# EAGLE design EKG_Pulse_Detection (EAGLE 9.3.1)
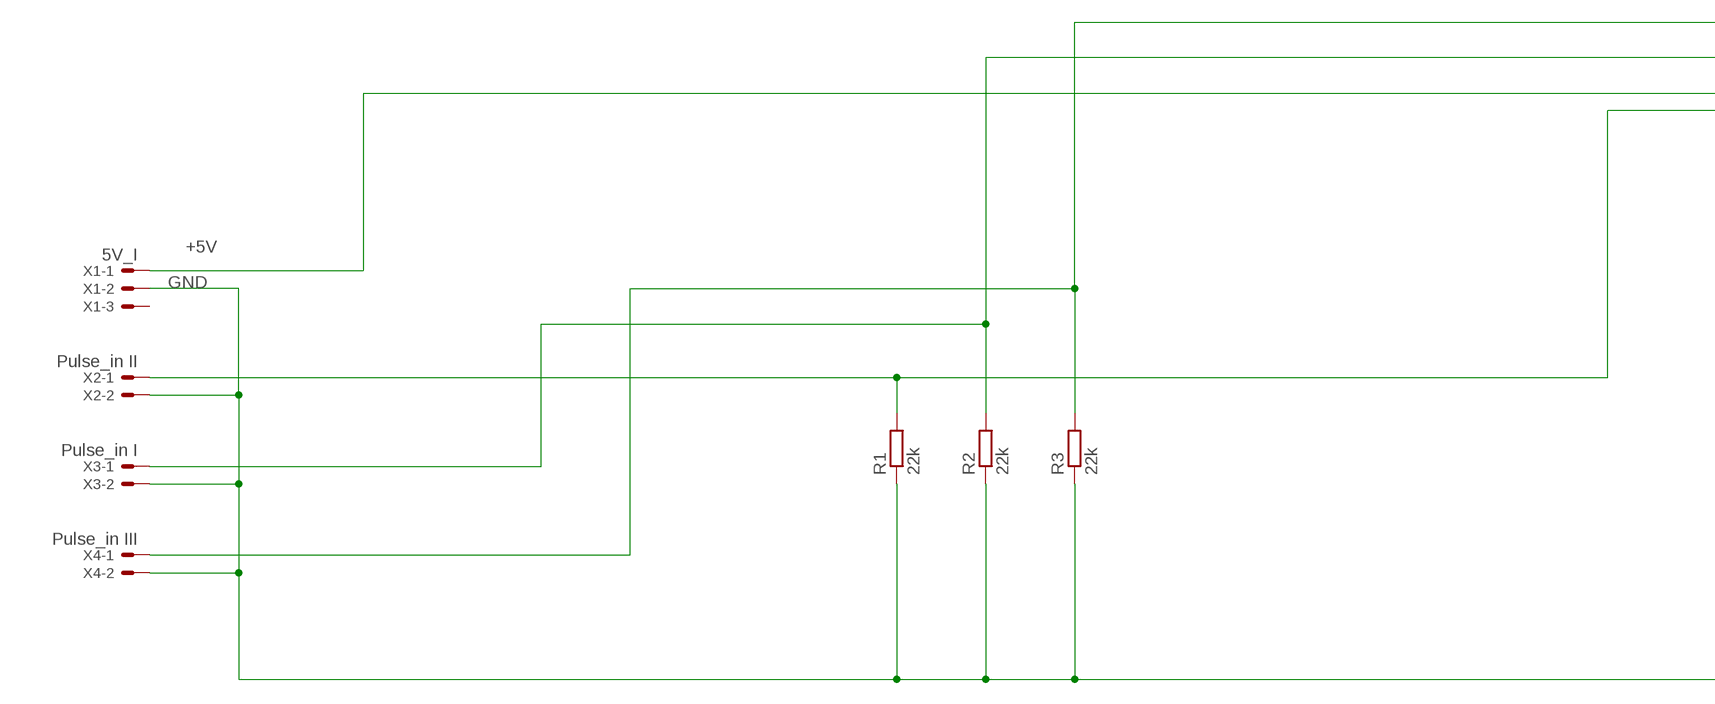
[diagram p0: schematic, sheet 1, part 1 of 2]
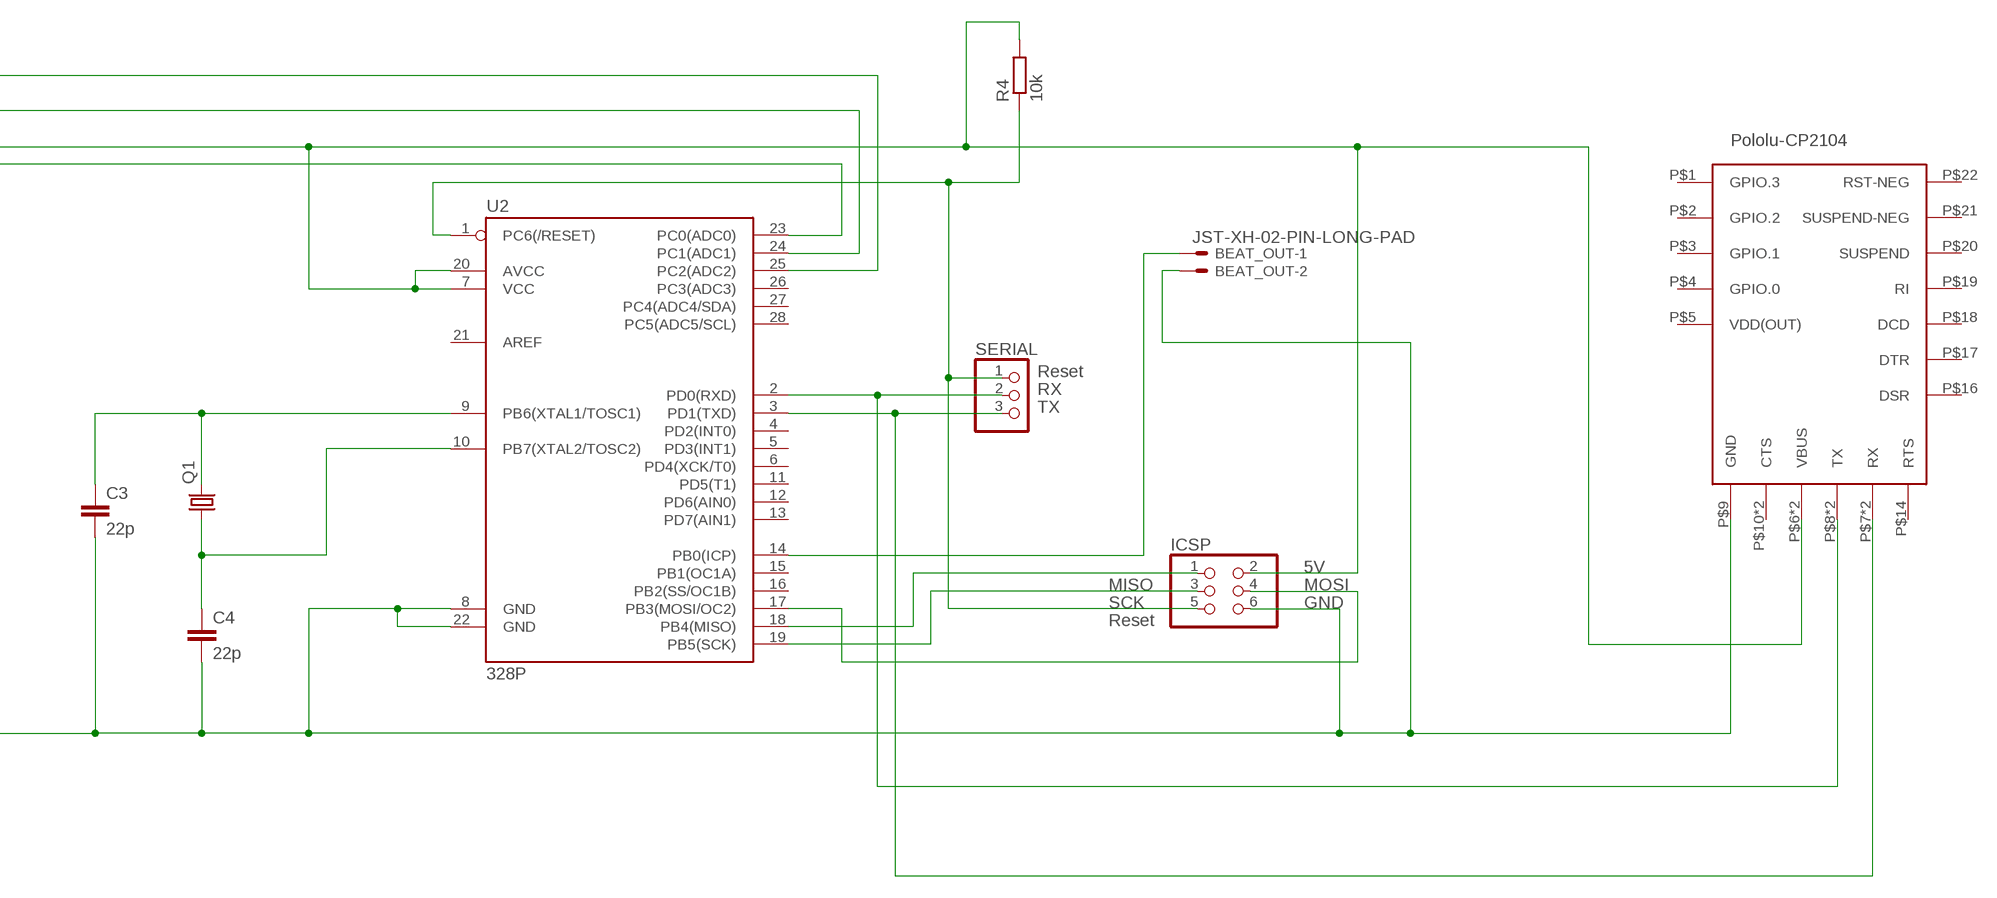
[diagram p1: schematic, sheet 1, part 2 of 2]

## Parts
BEAT_OUT  JST-XH-02-PIN-LONG-PAD  [JST-XH-02-PACKAGE-LONG-PAD]
C3  22p  C2,5-3  [C2.5-3]
C4  22p  C2,5-3  [C2.5-3]
ICSP  PINHD-2X3  [2X03]
Q1  CRYSTALHC49S  [HC49/S]
R1  22k  R-EU_0207/7  [0207/7]
R2  22k  R-EU_0207/7  [0207/7]
R3  22k  R-EU_0207/7  [0207/7]
R4  10k  R-EU_0207/7  [0207/7]
SERIAL  PINHD-1X3  [1X03]
U2  328P  ATMEGA328P_PDIP  [DIP28]
U$1  POLOLU_CP2104  [POLOLUCP2104]
X1  5V_I  JST-XH-03-PIN-LONG-PAD  [JST-XH-03-PACKAGE-LONG-PAD]
X2  Pulse_in II  JST-XH-02-PIN-LONG-PAD  [JST-XH-02-PACKAGE-LONG-PAD]
X3  Pulse_in I  JST-XH-02-PIN-LONG-PAD  [JST-XH-02-PACKAGE-LONG-PAD]
X4  Pulse_in III  JST-XH-02-PIN-LONG-PAD  [JST-XH-02-PACKAGE-LONG-PAD]

## Nets
+5V: ICSP.2 R4.2 U2.7(VCC) U2.20(AVCC) U$1.P$6(VBUS) U$1.P$11(VBUS) X1.1
GND: BEAT_OUT.2 C3.2 C4.2 ICSP.6 R1.1 R2.1 R3.1 U2.8(GND) U2.22(GND) U$1.P$9(GND) X1.2 X2.2 X3.2 X4.2
N$1: R1.2 U2.23(PC0(ADC0)) X2.1
N$2: R2.2 U2.24(PC1(ADC1)) X3.1
N$3: R3.2 U2.25(PC2(ADC2)) X4.1
N$9: C3.1 Q1.2 U2.9(PB6(XTAL1/TOSC1))
N$10: C4.1 Q1.1 U2.10(PB7(XTAL2/TOSC2))
N$12: ICSP.1 U2.18(PB4(MISO))
N$17: ICSP.3 U2.19(PB5(SCK))
N$19: ICSP.4 U2.17(PB3(MOSI/OC2))
N$21: BEAT_OUT.1 U2.14(PB0(ICP))
RESET: ICSP.5 R4.1 SERIAL.1 U2.1(PC6(/RESET))
RX: SERIAL.2 U2.2(PD0(RXD)) U$1.P$8(TX) U$1.P$12(TX)
TX: SERIAL.3 U2.3(PD1(TXD)) U$1.P$7(RX) U$1.P$13(RX)
Unconnected: U2.4(PD2(INT0)) U2.5(PD3(INT1)) U2.6(PD4(XCK/T0)) U2.11(PD5(T1)) U2.12(PD6(AIN0)) U2.13(PD7(AIN1)) U2.15(PB1(OC1A)) U2.16(PB2(SS/OC1B)) U2.21(AREF) U2.26(PC3(ADC3)) U2.27(PC4(ADC4/SDA)) U2.28(PC5(ADC5/SCL)) U$1.P$1(GPIO.3) U$1.P$2(GPIO.2) U$1.P$3(GPIO.1) U$1.P$4(GPIO.0) U$1.P$10(CTS) U$1.P$14(RTS) U$1.P$15(CTS) U$1.P$16(DSR) U$1.P$17(DTR) U$1.P$18(DCD) U$1.P$19(RI) U$1.P$20(SUSPEND) U$1.P$21(SUSPEND-NEG) U$1.P$22(RST-NEG) X1.3

## Notes on the sheet
- Reset
- RX
- TX
- 5V
- MISO | MOSI
- SCK | GND
- Reset

## Power pins joined to a net without a drawn wire
VDD(OUT): U$1.P$5(VDD(OUT))

## Library data of the parts
BEAT_OUT X2-X4 = Rembrandt Electronics - JST XH Connectors v1-0:JST-XH-02-PIN: JST XH Connector 2 Pin Wire to board connector. Pitch: 2,54 mm, (0.100") Number of pins: 2 Created by Rembrandt Electronics www.rembrandtelectronics.com
C3 C4 = capacitor-wima:C: CAPACITOR naming: grid - package width
ICSP = pinhead:PINHD-2X3: PIN HEADER
Q1 = adafruit:CRYSTAL: CRYSTAL; OC_FARNELL: 1667008; OC_NEWARK: unknown
R1-R4 = rcl:R-EU_: RESISTOR, European symbol; SPICEPREFIX: R
SERIAL = pinhead:PINHD-1X3: PIN HEADER
U2 = SparkFun-IC-Microcontroller:ATMEGA328P_PDIP: Atmel 328P Through hole ATMEGA328P uC used in the Arduino 32kb flash, 1k EEPROM, 2k SRAM Datasheet <http://www.sparkfun.com/datasheets/Components/SMD/ATMega328.pdf> SparkFun Products Storefront component: AVR 28 Pin 20MHz 32K 6A/D - ATMega328P <https://www.sparkfun.com/products/9061> (COM-09061) SparkFun Simon Says - Through-Hole Soldering Kit <https://www.sparkfun.com/products/10547> (KIT-10547) SparkFun Learn to Solder - Simon Says <https://www.sparkfun.com/products/13708> (KIT-13708) SparkFun BigTime Watch Kit <https://www.sparkfun.com/products/11734> (KIT-11734) SparkFun ClockIt <https://www.sparkfun.com/products/10930> (KIT-10930) SparkFun Serial Enabled LCD Kit <https://www.sparkfun.com/products/10097> (LCD-10097) SparkFun Simon Tilts - Through Hole Soldering Kit <https://www.sparkfun.com/products/12634> (KIT-12634) SparkFun Frequency Counter Kit <https://www.sparkfun.com/products/10140> (KIT-10140) FabFM Radio Kit <https://www.sparkfun.com/products/11043> (KIT-11043) SparkFun Binary Blaster Kit <https://www.sparkfun.com/products/12037> (KIT-12037) SparkFun Metro-Gnome <https://www.sparkfun.com/products/9236> (KIT-09236) ATmega328 with Arduino Optiboot (Uno) <https://www.sparkfun.com/products/10524> (DEV-10524); PROD_ID: IC-09136
U$1 = POLOLU_CP2104:POLOLU_CP2104: TTL zu USB Konverter
X1 = Rembrandt Electronics - JST XH Connectors v1-0:JST-XH-03-PIN: JST XH Connector 2 Pin Wire to board connector. Pitch: 2,54 mm, (0.100") Number of pins: 3 Created by Rembrandt Electronics www.rembrandtelectronics.com

## Board
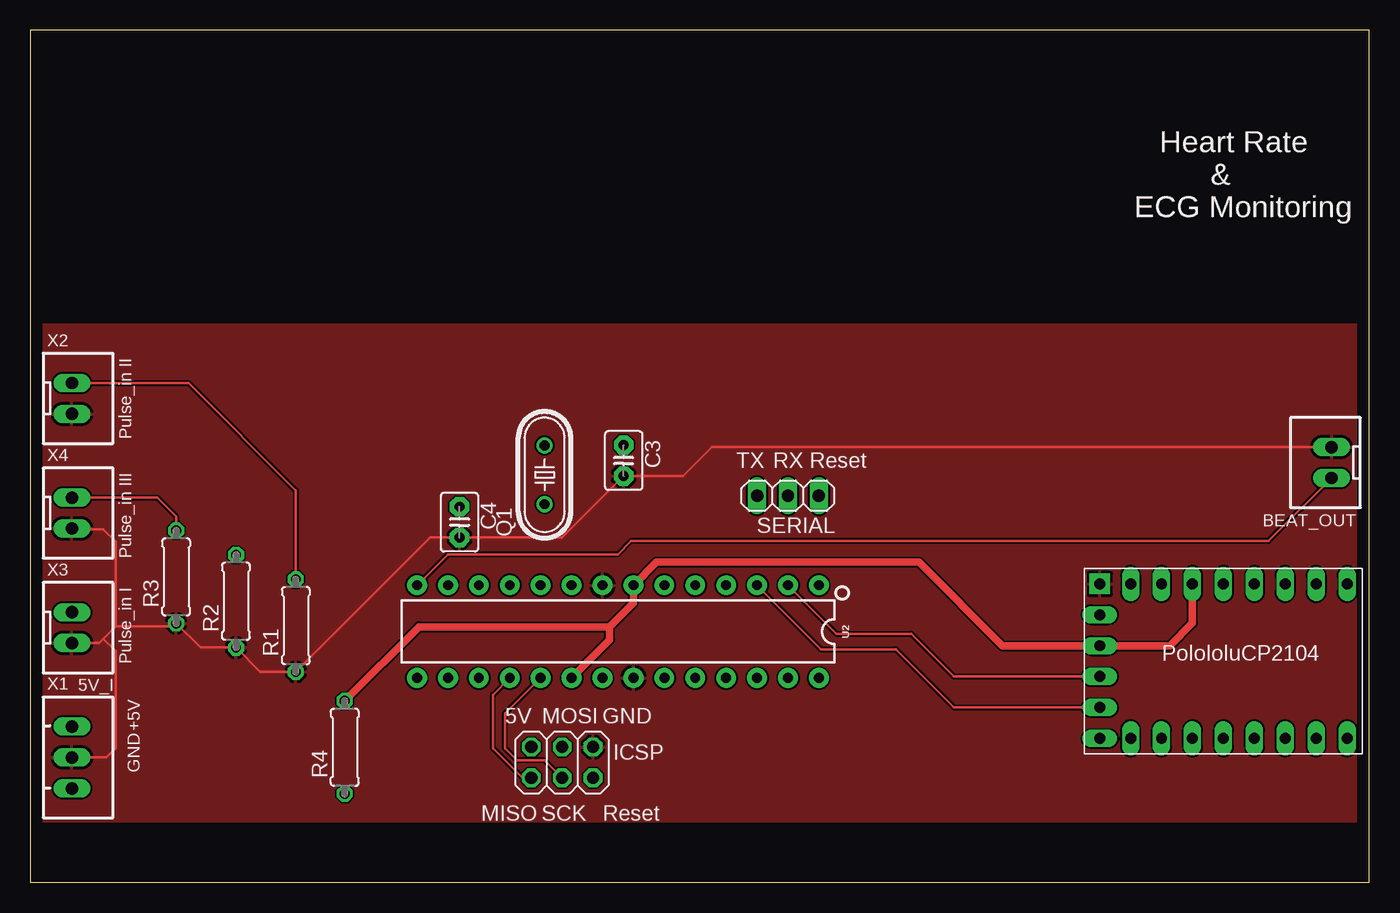
[diagram p2: board, top side]
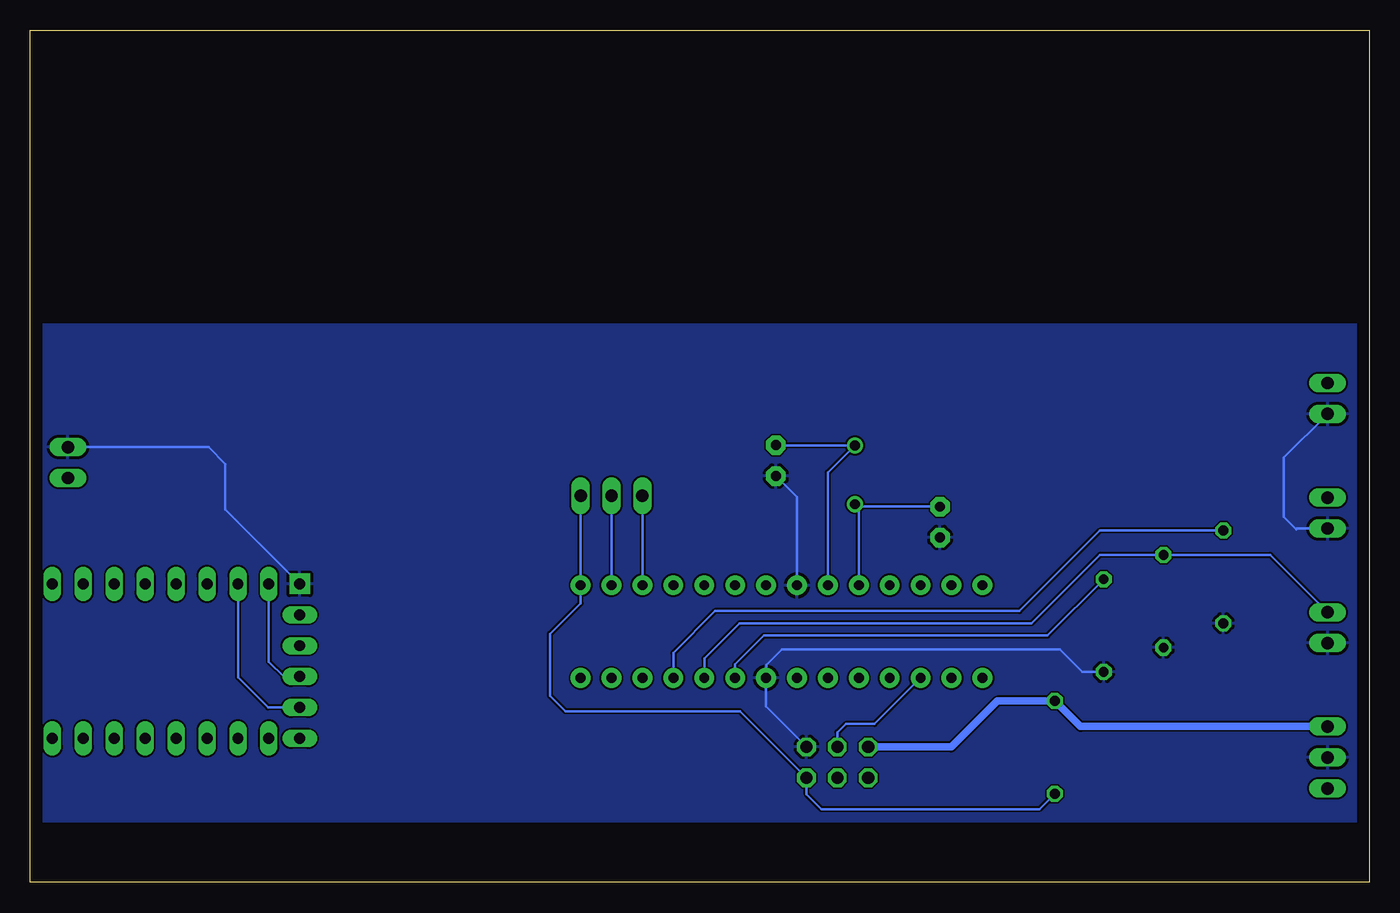
[diagram p3: board, bottom side, seen from below]

Size 110 x 70.01 mm. Coordinates in mm from the lower left corner, seen from the top.
Outline: 0,0 110,0 110,70.01 0,70.01 0,0
Copper layers (1*16): Top 0.035mm / dielectric 1.5mm / Bottom 0.035mm
Design rules "default": minimum track width 6mil, minimum drill 0.35mm, track to track 6mil, track to pad 6mil, pad to pad 6mil, via to via 6mil, smd to smd 6mil, copper to edge 40mil, drill to drill 6mil, minimum pad ring 10mil, minimum via ring 8mil, stop-mask expansion 4mil, vias tented up to drill 0mil, thermal gap 10mil

### Footprints (pad centres in the part's own frame; a part is rotated, then mirrored left to right if it is on the bottom)
JST-XH-02-PACKAGE-LONG-PAD = drill 1.016 long: 1 -1.27,0; 2 1.27,0
C2.5-3 = drill 0.813 pad 1.6 octagon: 1 -1.27,0; 2 1.27,0
2X03 = drill 1.016 octagon: 1 -2.54,-1.27; 2 -2.54,1.27; 3 0,-1.27; 4 0,1.27; 5 2.54,-1.27; 6 2.54,1.27
HC49/S = drill 0.813: 1 -2.413,0; 2 2.413,0
0207/7 = drill 0.813 octagon: 1 -3.81,0; 2 3.81,0
1X03 = drill 1.016 long: 1 -2.54,0; 2 0,0; 3 2.54,0
DIP28 = drill 0.813 pad 1.626: 1 -16.51,-3.81; 2 -13.97,-3.81; 3 -11.43,-3.81; 4 -8.89,-3.81; 5 -6.35,-3.81; 6 -3.81,-3.81; 7 -1.27,-3.81; 8 1.27,-3.81; 9 3.81,-3.81; 10 6.35,-3.81; 11 8.89,-3.81; 12 11.43,-3.81; 13 13.97,-3.81; 14 16.51,-3.81; 15 16.51,3.81; 16 13.97,3.81; 17 11.43,3.81; 18 8.89,3.81; 19 6.35,3.81; 20 3.81,3.81; 21 1.27,3.81; 22 -1.27,3.81; 23 -3.81,3.81; 24 -6.35,3.81; 25 -8.89,3.81; 26 -11.43,3.81; 27 -13.97,3.81; 28 -16.51,3.81
POLOLUCP2104 = drill 0.9 pad 1.422 long: P$1 1.27,-1.27; P$2 1.27,-3.81; P$3 1.27,-6.35; P$4 1.27,-8.89; P$5 1.27,-11.43; P$6 1.27,-13.97; P$7 1.27,-16.51; P$8 1.27,-19.05; P$10 3.81,-21.59; P$11 6.35,-21.59; P$12 8.89,-21.59; P$13 11.43,-21.59; P$14 13.97,-21.59; P$15 13.97,-19.05; P$16 13.97,-16.51; P$17 13.97,-13.97; P$18 13.97,-11.43; P$19 13.97,-8.89; P$20 13.97,-6.35; P$21 13.97,-3.81; P$22 13.97,-1.27 | drill 0.9 pad 1.676 square: P$9 1.27,-21.59
JST-XH-03-PACKAGE-LONG-PAD = drill 1.016 long: 1 -2.54,0; 2 0,0; 3 2.54,0

### Placement (x,y rotation side)
BEAT_OUT  106.92,34.5 90 top
C3  48.75,34.66 270 top
C4  35.25,29.6 270 top
ICSP  43.69,9.86 0 top
Q1  42.25,33.49 90 top
R1  21.81,21.1 90 top
R2  16.89,23.1 90 top
R3  11.97,25.1 90 top
R4  25.83,11.1 90 top
SERIAL  62.25,31.77 180 top
U2  48.28,20.61 180 top
U$1  109.46,25.8 270 top
X1  3.41,10.26 270 top
X2  3.41,39.77 270 top
X3  3.41,20.93 270 top
X4  3.41,30.35 270 top

### Tracks (layer width: path | path; a pad name or v marks a point on that pad's centre or on a via)
+5V
  Top 0.61: R4.2 31.92,21 47.6,21 | 47.6,21 49.55,22.95 U2.7 51.44,26.31 73,26.31 79.86,19.45 U$1.P$11 93.62,19.45 95.49,21.32 U$1.P$6 | U2.20 47.6,19.93 47.6,21
  Bottom 0.61: X1.1 23.72,12.8 R4.2 30.55,14.91 34.34,11.12 ICSP.2
GND
  Top 0.2: X4.2 3.47,29.02 6,29.02 7,28.02 7,21.02 | X3.2 5.64,19.66 6,20.02 | 7,21.02 6,20.02 | X1.2 6.24,10.26 7,11.02 7,19.02 6,20.02 | 7,21.02 11.7,21.02 R3.1 13.97,19.29 R2.1 18.89,17.29 R1.1 32.85,28.33 C4.2 43.69,28.33 C3.2 53.61,33.39 55.99,35.77 BEAT_OUT.2
  Bottom 0.2: X2.2 7,34.91 7,30.02 6,29.02 5.94,29.08 X4.2 | ICSP.6 49.55,14.45 U2.22 49.53,16.82 49.53,17.88 48.26,19.15 25.4,19.15 23.54,17.29 R1.1 | U2.8 47.01,31.65 C3.2 | U$1.P$9 93.98,30.64 93.98,34.39 95.36,35.77 BEAT_OUT.2
  pour Bottom: 0,45.82 110.49,45.82 110.49,5.02 0,5.02
  pour Top: 0,45.82 110.49,45.82 110.49,5.02 0,5.02
N$1
  Top 0.2: X2.1 13,41.02 21.81,32.21 R1.2
  Bottom 0.2: U2.23 52.09,17.93 49.73,20.29 26.43,20.29 R1.2
N$2
  Bottom 0.2: X3.1 8.12,26.91 R2.2 22.11,26.91 27.73,21.29 51.73,21.29 54.63,18.39 U2.24
N$3
  Top 0.2: X4.1 10.4,31.62 11.97,30.05 R3.2
  Bottom 0.2: R3.2 22.11,28.91 28.73,22.29 53.73,22.29 57.17,18.85 U2.25
N$9
  Bottom 0.2: C3.1 48.72,35.9 Q1.2 44.47,33.68 U2.9
N$10
  Bottom 0.2: C4.1 42.04,30.87 Q1.1 41.93,30.75 U2.10
N$12
  Top 0.2: ICSP.1 40.43,8.59 38,11.02 38,15.41 U2.18
N$17
  Top 0.2: ICSP.3 42.26,10.02 40,10.02 39,11.02 39,13.87 U2.19
N$19
  Bottom 0.2: U2.17 40.63,13.02 43,13.02 43.69,12.33 ICSP.4
N$21
  Top 0.2: U2.14 34.31,26.96 48.28,26.96 49.36,28.04 101.73,28.04 BEAT_OUT.1
RESET
  Bottom 0.2: R4.1 27.1,6.02 45,6.02 46.23,7.25 ICSP.5 51.71,14.07 66.04,14.07 67.31,15.34 67.31,20.42 64.79,22.94 U2.1 SERIAL.1
RX
  Top 0.2: U2.2 66.25,20.42 72.39,20.42 75.9,16.91 U$1.P$12
  Bottom 0.2: SERIAL.2 U2.2 | U$1.P$8 90.41,18.12 89.2,16.91 U$1.P$12
TX
  Top 0.2: U2.3 64.98,19.15 71.12,19.15 75.9,14.37 U$1.P$13
  Bottom 0.2: SERIAL.3 U2.3 | U$1.P$13 90.47,14.37 92.95,16.85 U$1.P$7

### Text on the board
tNames: Heart Rate / & / ECG Monitoring | TX | RX | Reset | +5V | 5V | MOSI | GND | GND | MISO | SCK | Reset